# Altium schematic sheet power_supply.SchDoc
size 594 x 420 mm; PageSetup: Record=PageOptions|CenterHorizontal=True|CenterVertical=True|PrintScale=0.94|XCorrection=1.00|YCorrection=1.00|PrintKind=1|BorderSize=5000000|LeftOffset=0|BottomOffset=0|Orientation=1|PaperLength=1000|PaperWidth=1000|Scale=100|PaperSource=7|PrintQuality=-4|MediaType=1|DitherType=10|PaperKind=A4|PrintScaleMode=1; DecimalNumber: Децимальный номер; HeadOfSector: Нач. сектора; MainDevice: Перв.примен.; Name: Наименование
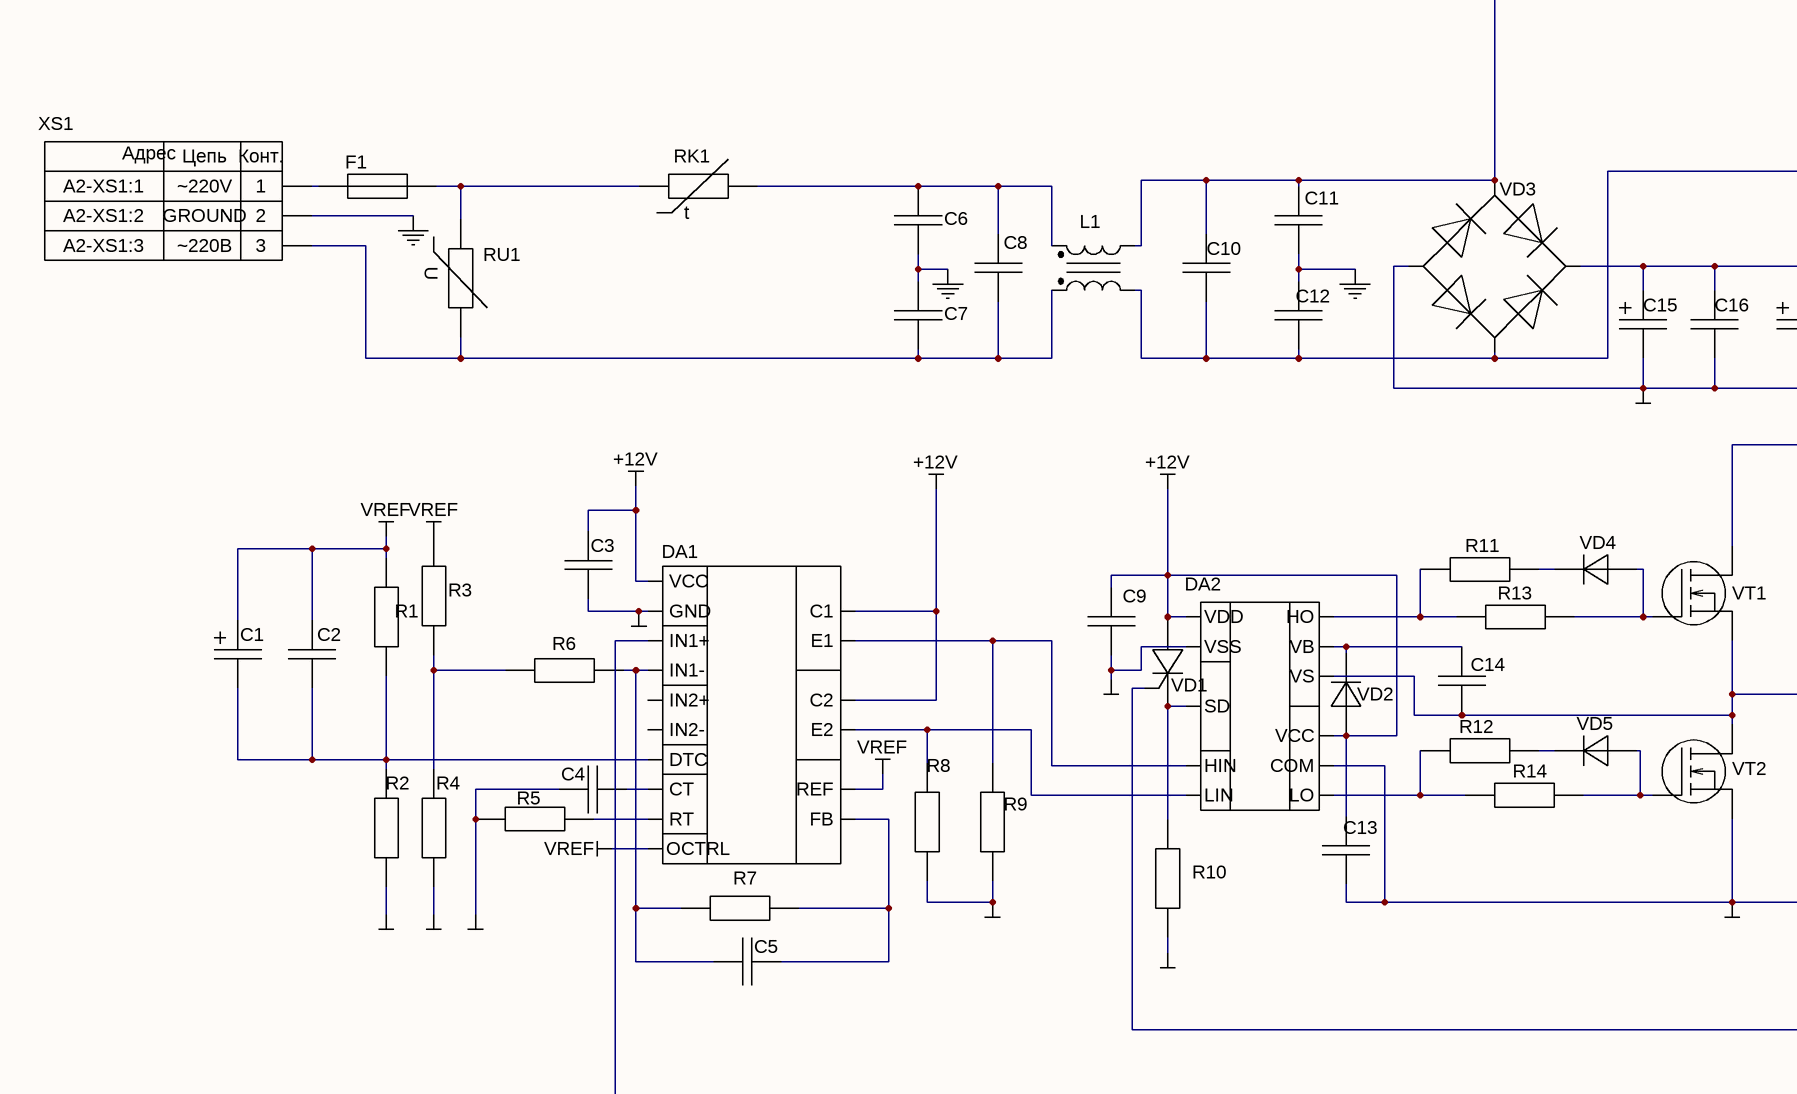
[diagram p0: power_supply.SchDoc, left]
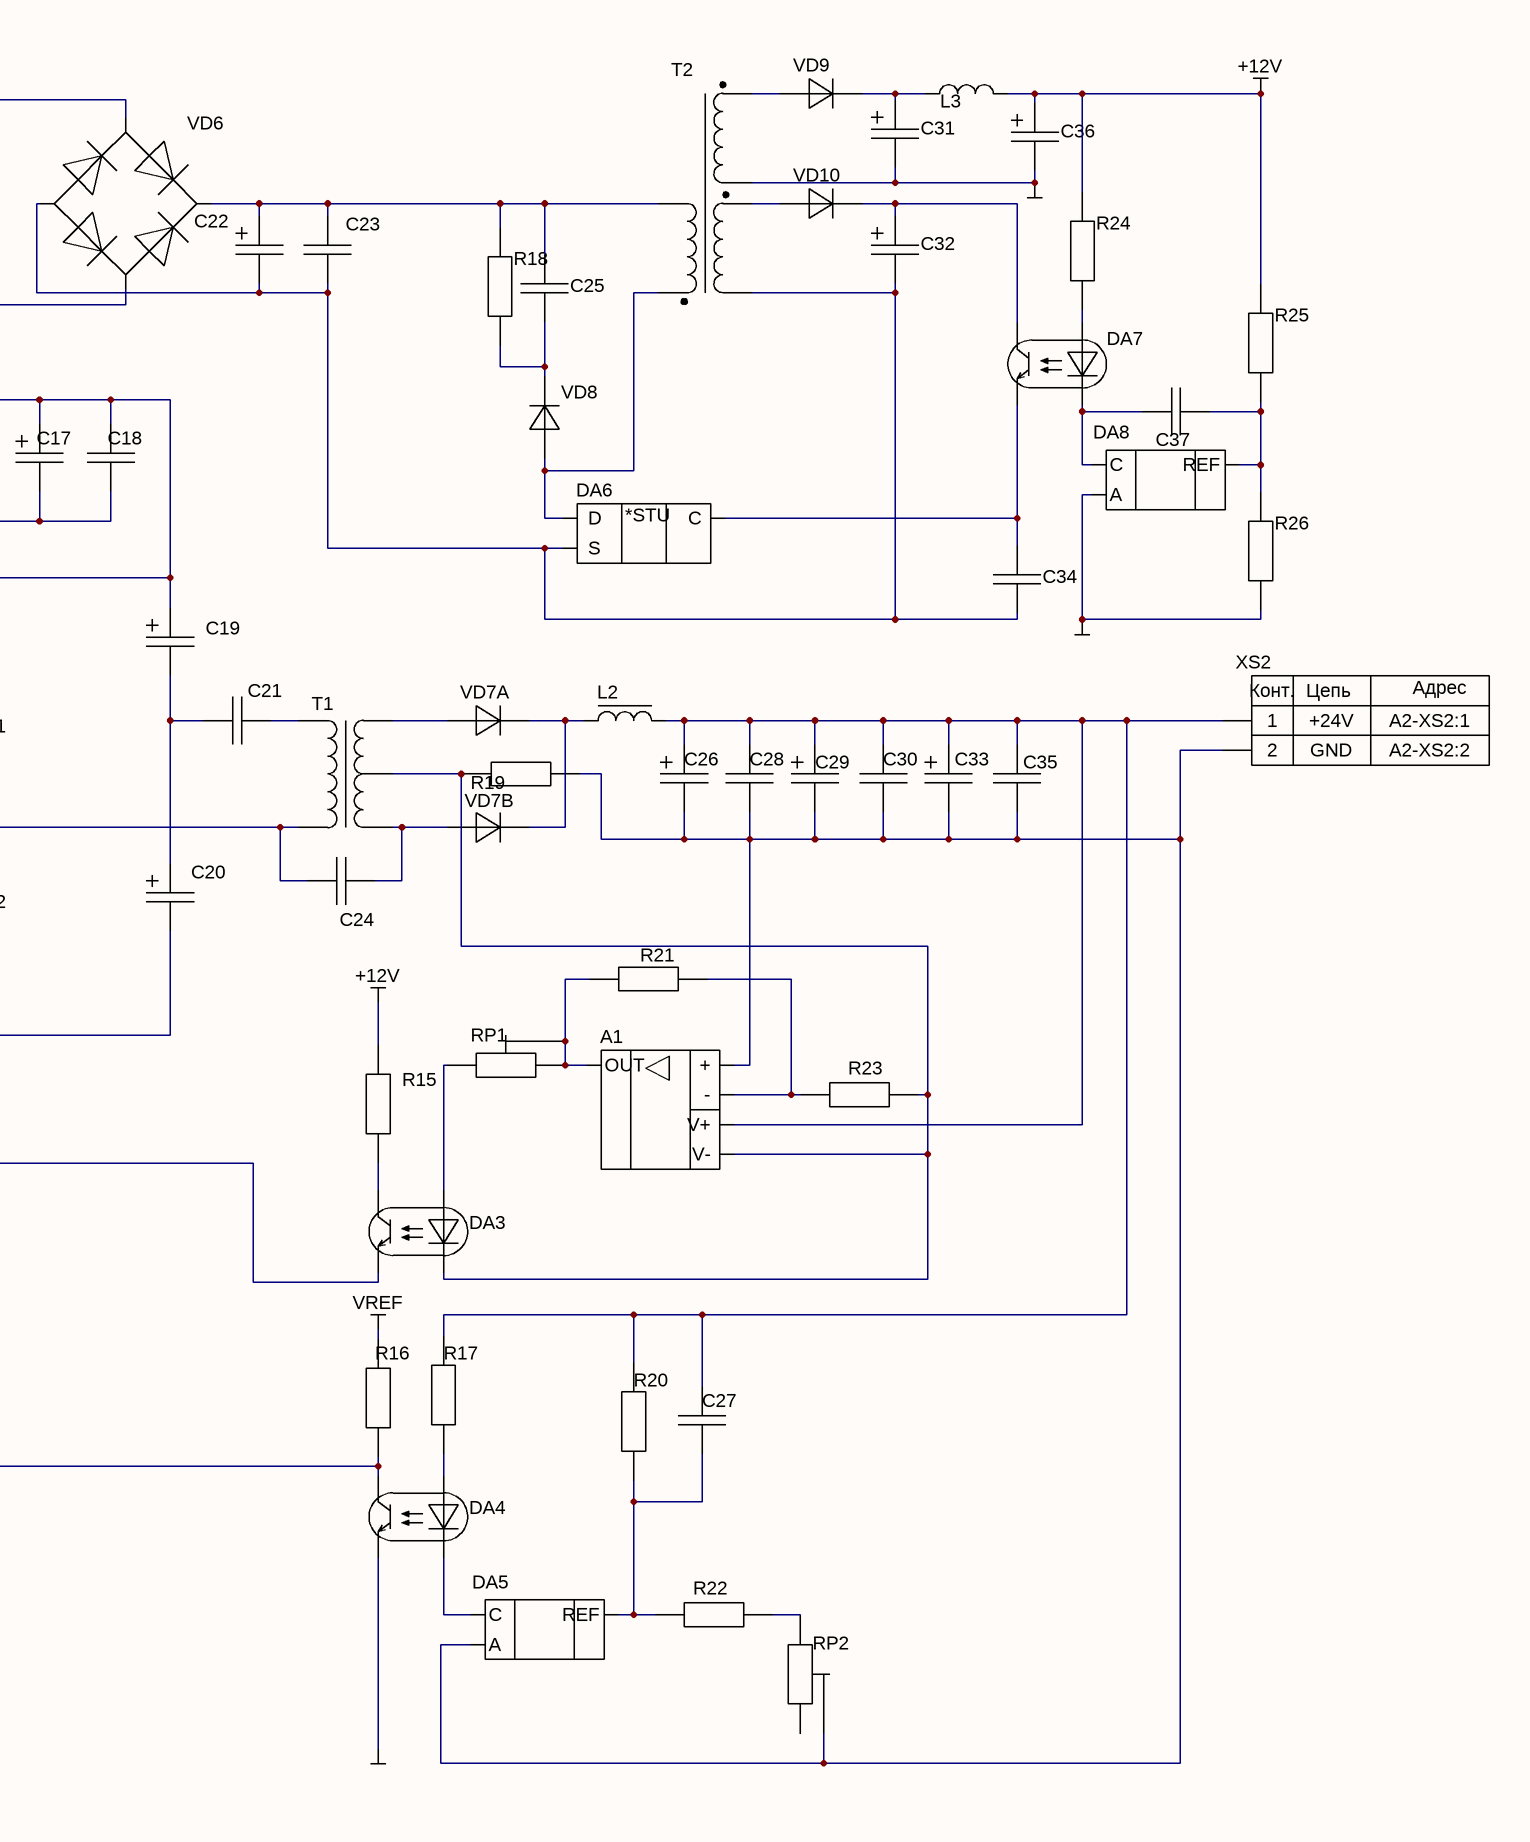
[diagram p1: power_supply.SchDoc, right]

## Parts
A1  LMV321ILT  (value not drawn)
C1  100мкФ  (value not drawn)
C2  100 нФ  (value not drawn)
C3  1 мкФ  (value not drawn)
C4  2.2 нФ  (value not drawn)
C5  1 мкФ  (value not drawn)
C6  1 нФ  [CAP: B32021]  (value not drawn)
C7  1 нФ  [CAP: B32021]  (value not drawn)
C8  470 нФ  [B32922]  (value not drawn)
C9  1 мкФ  (value not drawn)
C10  470 нФ  [B32922]  (value not drawn)
C11  1 нФ  [CAP: B32021]  (value not drawn)
C12  1 нФ  [CAP: B32021]  (value not drawn)
C13  1 мкФ  (value not drawn)
C14  1 мкФ  (value not drawn)
C15  220 мкФ  (value not drawn)
C16  100 нФ  (value not drawn)
C17  220 мкФ  (value not drawn)
C18  100 нФ  (value not drawn)
C19  10 мкФ  (value not drawn)
C20  10 мкФ  (value not drawn)
C21  1 мкФ  (value not drawn)
C22  100 мкФ  (value not drawn)
C23  100 нФ  (value not drawn)
C24  1 нФ  (value not drawn)
C25  C_const  (value not drawn)
C26  3300 мкФ  (value not drawn)
C27  1 мкФ  (value not drawn)
C28  100 нФ  (value not drawn)
C29  3300 мкФ  (value not drawn)
C30  100 нФ  (value not drawn)
C31  C_pol  (value not drawn)
C32  C_pol  (value not drawn)
C33  3300 мкФ  (value not drawn)
C34  C_const  (value not drawn)
C35  100 нФ  (value not drawn)
C36  C_pol  (value not drawn)
C37  C_const  (value not drawn)
DA1  tl494  (value not drawn)
DA2  ir2110  (value not drawn)
DA3  LTV-814  (value not drawn)
DA4  LTV-814  (value not drawn)
DA5  tl431  (value not drawn)
DA6  top227  (value not drawn)
DA7  opt  (value not drawn)
DA8  tl431  (value not drawn)
F1  2А  [FUSE: 1812]  (value not drawn)
L1  4.7 мГн  [IND: B82721]  (value not drawn)
L2  choke  (value not drawn)
L3  L  (value not drawn)
R1  91 кОм  (value not drawn)
R2  10 кОм  (value not drawn)
R3  5.1 кОм  (value not drawn)
R4  5.1 кОм  (value not drawn)
R5  12 кОм  (value not drawn)
R6  510 Ом  (value not drawn)
R7  51 кОм  (value not drawn)
R8  1 кОм  (value not drawn)
R9  1 кОм  (value not drawn)
R10  1 кОм  (value not drawn)
R11  22 Ом  (value not drawn)
R12  22 Ом  (value not drawn)
R13  22 Ом  (value not drawn)
R14  22 Ом  (value not drawn)
R15  1 кОм  (value not drawn)
R16  10 кОм  (value not drawn)
R17  680 Ом  (value not drawn)
R18  Res  (value not drawn)
R19  1 мОм  (value not drawn)
R20  22 кОм  (value not drawn)
R21  100 кОм  (value not drawn)
R22  2 кОм  (value not drawn)
R23  1 кОм  (value not drawn)
R24  Res  (value not drawn)
R25  Res  (value not drawn)
R26  Res  (value not drawn)
RK1  JNR15S121L  [RES: B57237 (NTC)]  (value not drawn)
RP1  5 кОм  (value not drawn)
RP2  5 кОм  (value not drawn)
RU1  MOV-07D431K  [RES: MOV-07D431K]  (value not drawn)
T1  Trans_1_2  (value not drawn)
T2  trans_1_2_isol  (value not drawn)
VD1  BT149D  (value not drawn)
VD2  1n4004  (value not drawn)
VD3  GBU6K-BP  [DIODE: GBU]  (value not drawn)
VD4  VS-HFA04TB60-M3  (value not drawn)
VD5  VS-HFA04TB60-M3  (value not drawn)
VD6  GBU6K-BP  [DIODE: GBU]  (value not drawn)
VD7  STPS30H100CT  (value not drawn)  (parts A,B of 2)
VD8  VD  (value not drawn)
VD9  VD  (value not drawn)
VD10  VD  (value not drawn)
VT1  STP9NK50Z  (value not drawn)
VT2  STP9NK50Z  (value not drawn)
XS1  circuit1: ~220V  circuit2: GROUND  circuit3: ~220В  =address1: A2-XS1:1  =address2: A2-XS1:2  =address3: A2-XS1:3  (hidden comment: X3)
XS2  circuit2: GND  circuit1: +24V  =address2: A2-XS2:2  =address1: A2-XS2:1  (hidden comment: X2)

## Nets
+12V: C3.1 C9.2 C13.2 C36.1 DA1.8(C1) DA1.11(C2) DA1.12(VCC) DA2.3(VCC) DA2.11(VDD) L3.2 R15.6 R24.2 R25.2 VD1.2 VD2.1
GND: C3.2 C4.1 C9.1 C13.1 C15.2 C16.1 C17.2 C18.1 C20.2 C31.2 C36.2 DA1.7(GND) DA2.2(COM) DA2.15(VSS) DA4.4 DA8.3(A) R2.5 R4.5 R5.5 R8.5 R9.5 R10.5 R26.1 T2.4 VD3.4 VT2.25
SH: C6.1 C7.2 C11.2 C12.1 XS1.2
VREF: C1.1 C2.2 DA1.13(OCTRL) DA1.14(REF) R1.5 R3.6 R16.5
NetA1_1: A1.1(+) C26.2 C28.1 C29.2 C30.2 C33.2 C35.2 DA5.3(A) R19.6 RP2.3 XS2.2
NetA1_2: A1.2(V-) DA3.2 R19.5 R23.6 T1.5
NetA1_3: A1.3(-) R21.6 R23.5
NetA1_4: A1.4(OUT) R21.5 RP1.2 RP1.3
NetA1_5: A1.5(V+) C26.1 C27.1 C28.2 C29.1 C30.1 C33.1 C35.1 L2.2 R17.5 R20.5 XS2.1
NetC1_2: C1.2 C2.1 DA1.4(DTC) R1.6 R2.6
NetC4_2: C4.2 DA1.5(CT)
NetC5_1: C5.1 DA1.2(IN1-) R6.6 R7.5
NetC5_2: C5.2 DA1.3(FB) R7.6
NetC6_2: C6.2 C8.2 L1.1 RK1.2
NetC7_1: C7.1 C8.1 L1.3 RU1.2 XS1.3
NetC10_1: C10.1 C12.2 L1.4 VD3.2 VD6.2
NetC10_2: C10.2 C11.1 L1.2 VD3.1 VD6.1
NetC14_1: C14.1 DA2.7(VB) VD2.2
NetC14_2: C14.2 C24.1 DA2.6(VS) T1.2 VT1.25 VT2.24
NetC15_1: C15.1 C16.2 C17.1 C18.2 C19.1 VD3.3 VT1.24
NetC19_2: C19.2 C20.1 C21.1
NetC21_2: C21.2 T1.1
NetC22_1: C22.1 C23.1 C25.2 R18.2 T2.1 VD6.3
NetC22_2: C22.2 C23.2 C32.2 C34.1 DA6.2(S) T2.4 VD6.4
NetC24_2: C24.2 T1.4 VD7.3(A2)
NetC25_1: C25.1 R18.1 VD8.2
NetC27_2: C27.2 DA5.2(REF) R20.6 R22.5
NetC31_1: C31.1 L3.1 VD9.2
NetC32_1: C32.1 DA7.3 VD10.2
NetC34_2: C34.2 DA6.3(C) DA7.4
NetC37_1: C37.1 DA8.2(REF) R25.1 R26.2
NetC37_2: C37.2 DA7.2 DA8.1(C)
NetDA1_1: DA1.1(IN1+) DA4.3 R16.6
NetDA1_6: DA1.6(RT) R5.6
NetDA1_9: DA1.9(E1) DA2.12(HIN) R9.6
NetDA1_10: DA1.10(E2) DA2.14(LIN) R8.6
NetDA2_1: DA2.1(LO) R12.5 R14.5
NetDA2_8: DA2.8(HO) R11.5 R13.5
NetDA2_13: DA2.13(SD) R10.6 VD1.1
NetDA3_1: DA3.1 RP1.1
NetDA3_3: DA3.3 R15.5
NetDA3_4: DA3.4 VD1.3
NetDA4_1: DA4.1 R17.6
NetDA4_2: DA4.2 DA5.1(C)
NetDA6_1: DA6.1(D) T2.2 VD8.1
NetDA7_1: DA7.1 R24.1
NetF1_1: F1.1 XS1.1
NetF1_2: F1.2 RK1.1 RU1.1
NetL2_1: L2.1 VD7.2(K)
NetR3_5: R3.5 R4.6 R6.5
NetR11_6: R11.6 VD4.2
NetR12_6: R12.6 VD5.2
NetR13_6: R13.6 VD4.1 VT1.26
NetR14_6: R14.6 VD5.1 VT2.26
NetR22_6: R22.6 RP2.1
NetT1_3: T1.3 VD7.1(A1)
NetT2_3: T2.3 VD9.1
NetT2_3: T2.3 VD10.1  [a separate net that carries the same name]

Not connected (* = marked no-connect by the designer): DA1 15(IN2-) 16(IN2+); RP2 2

## Notes on the sheet
- Перв.примен.
- Справ.№
- Подп. и дата
- Инв.№ дубл.
- Взам.инв.№
- Подп.и дата
- Разраб.
- Изм.
- Лист
- № докум.
- Подп.
- Дата
- Лит.
- Масштаб
- Масса
- Т.контр.
- Пров.
- Листов
- Инв.№ подл.
- Утв.
- Н.контр.
- Нач.сект.
- Формат  A2
- (in symbol RK) t
- (in symbol RU) U
- (in symbol top227) *STU
- (in symbol X2) Конт.; Цепь; Адрес
- (in symbol X3) Цепь; Конт.; Адрес

## Library data of the parts
A1 = single_channel_op_amp
C1 C15 C17 C19 C20 C22 C26 C29 C33 = C_pol
C2-C14 C16 C18 C21 C23 C24 C27 C28 C30 C35 = C_const
DA3 DA4 = opt
F1 = fuse
L1 = L_sin
R1-R17 R19-R23 = Res
RK1 = RK
RP1 RP2 = pot
RU1 = RU
VD1 = tiristor
VD2 VD4 VD5 = VD
VD3 VD6 = d_bridge
VD7 = pair_diodes_cat
VT1 VT2 = mosfet